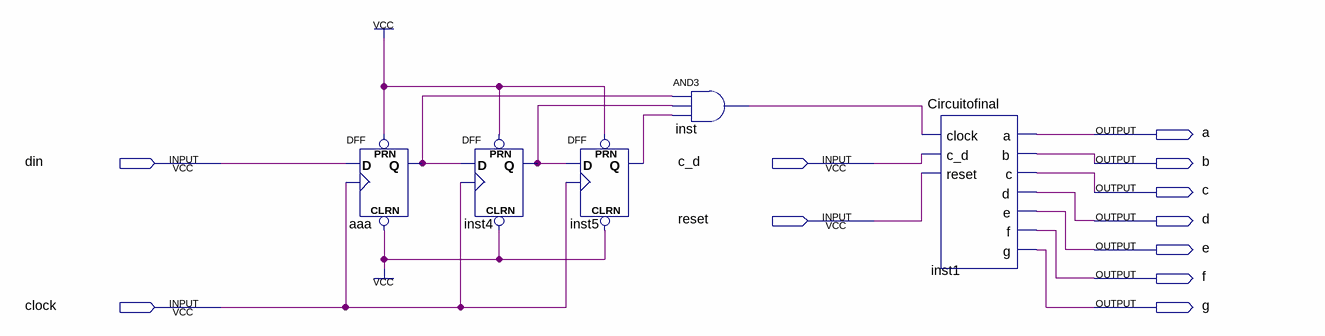
[diagram p0: schematic sheet]
// Quartus schematic contadorbidimcomfilter.bdf as structural Verilog: 5 symbols, 11 pins
module contadorbidimcomfilter (
  input  din,
  input  c_d,
  input  reset,
  input  clock,
  output a,
  output b,
  output c,
  output d,
  output e,
  output f,
  output g
);

  wire aaa_q, inst4_q, inst5_q, inst_out;

  DFF aaa (.CLRN(1'b1), .CLK(clock), .D(din), .PRN(1'b1), .Q(aaa_q));
  DFF inst4 (.CLRN(1'b1), .CLK(clock), .D(aaa_q), .PRN(1'b1), .Q(inst4_q));
  DFF inst5 (.CLRN(1'b1), .CLK(clock), .D(inst4_q), .PRN(1'b1), .Q(inst5_q));
  and inst (inst_out, aaa_q, inst4_q, inst5_q);
  Circuitofinal inst1 (.clock(inst_out), .c_d(c_d), .reset(reset), .a(a), .b(b), .c(c), .d(d), .e(e), .f(f), .g(g));
endmodule
